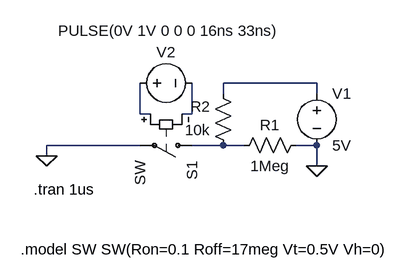
[diagram p0: schematic Output test board pullup.asc]
Output test board pullup.asc, the LTspice schematic file:
Version 4
SHEET 1 880 680
WIRE 272 0 128 0
WIRE 128 16 128 0
WIRE 272 16 272 0
WIRE 0 48 0 0
WIRE 16 48 0 48
WIRE 80 48 80 0
WIRE 80 48 64 48
WIRE 0 96 -144 96
WIRE 128 96 80 96
WIRE 160 96 128 96
WIRE 272 96 240 96
WIRE -144 112 -144 96
WIRE 272 128 272 96
FLAG 272 128 0
FLAG -144 112 0
SYMBOL res 256 80 R90
WINDOW 0 0 56 VBottom 2
WINDOW 3 32 56 VTop 2
SYMATTR InstName R1
SYMATTR Value 1Meg
SYMBOL voltage 272 0 R0
WINDOW 123 0 0 Left 0
WINDOW 39 0 0 Left 0
SYMATTR InstName V1
SYMATTR Value 5V
SYMBOL sw 96 96 R90
SYMATTR InstName S1
SYMBOL voltage -16 0 R270
WINDOW 0 32 56 VTop 2
WINDOW 3 96 59 VBottom 2
WINDOW 123 0 0 Left 0
WINDOW 39 0 0 Left 0
SYMATTR InstName V2
SYMATTR Value PULSE(0V 1V 0 0 0 16ns 33ns)
SYMBOL res 144 112 R180
WINDOW 0 36 76 Left 2
WINDOW 3 36 40 Left 2
SYMATTR InstName R2
SYMATTR Value 10k
TEXT -164 164 Left 2 !.tran 1us
TEXT -184 256 Left 2 !.model SW SW(Ron=0.1 Roff=17meg Vt=0.5V Vh=0)

The netlist it stands for:
* Output test board pullup.asc
R1 0 N004 1Meg
V1 N001 0 5V
S1 N004 0 N002 N003 SW
V2 N002 N003 PULSE(0V 1V 0 0 0 16ns 33ns)
R2 N004 N001 10k
.tran 1us
.model SW SW(Ron=0.1 Roff=17meg Vt=0.5V Vh=0)
.backanno
.end